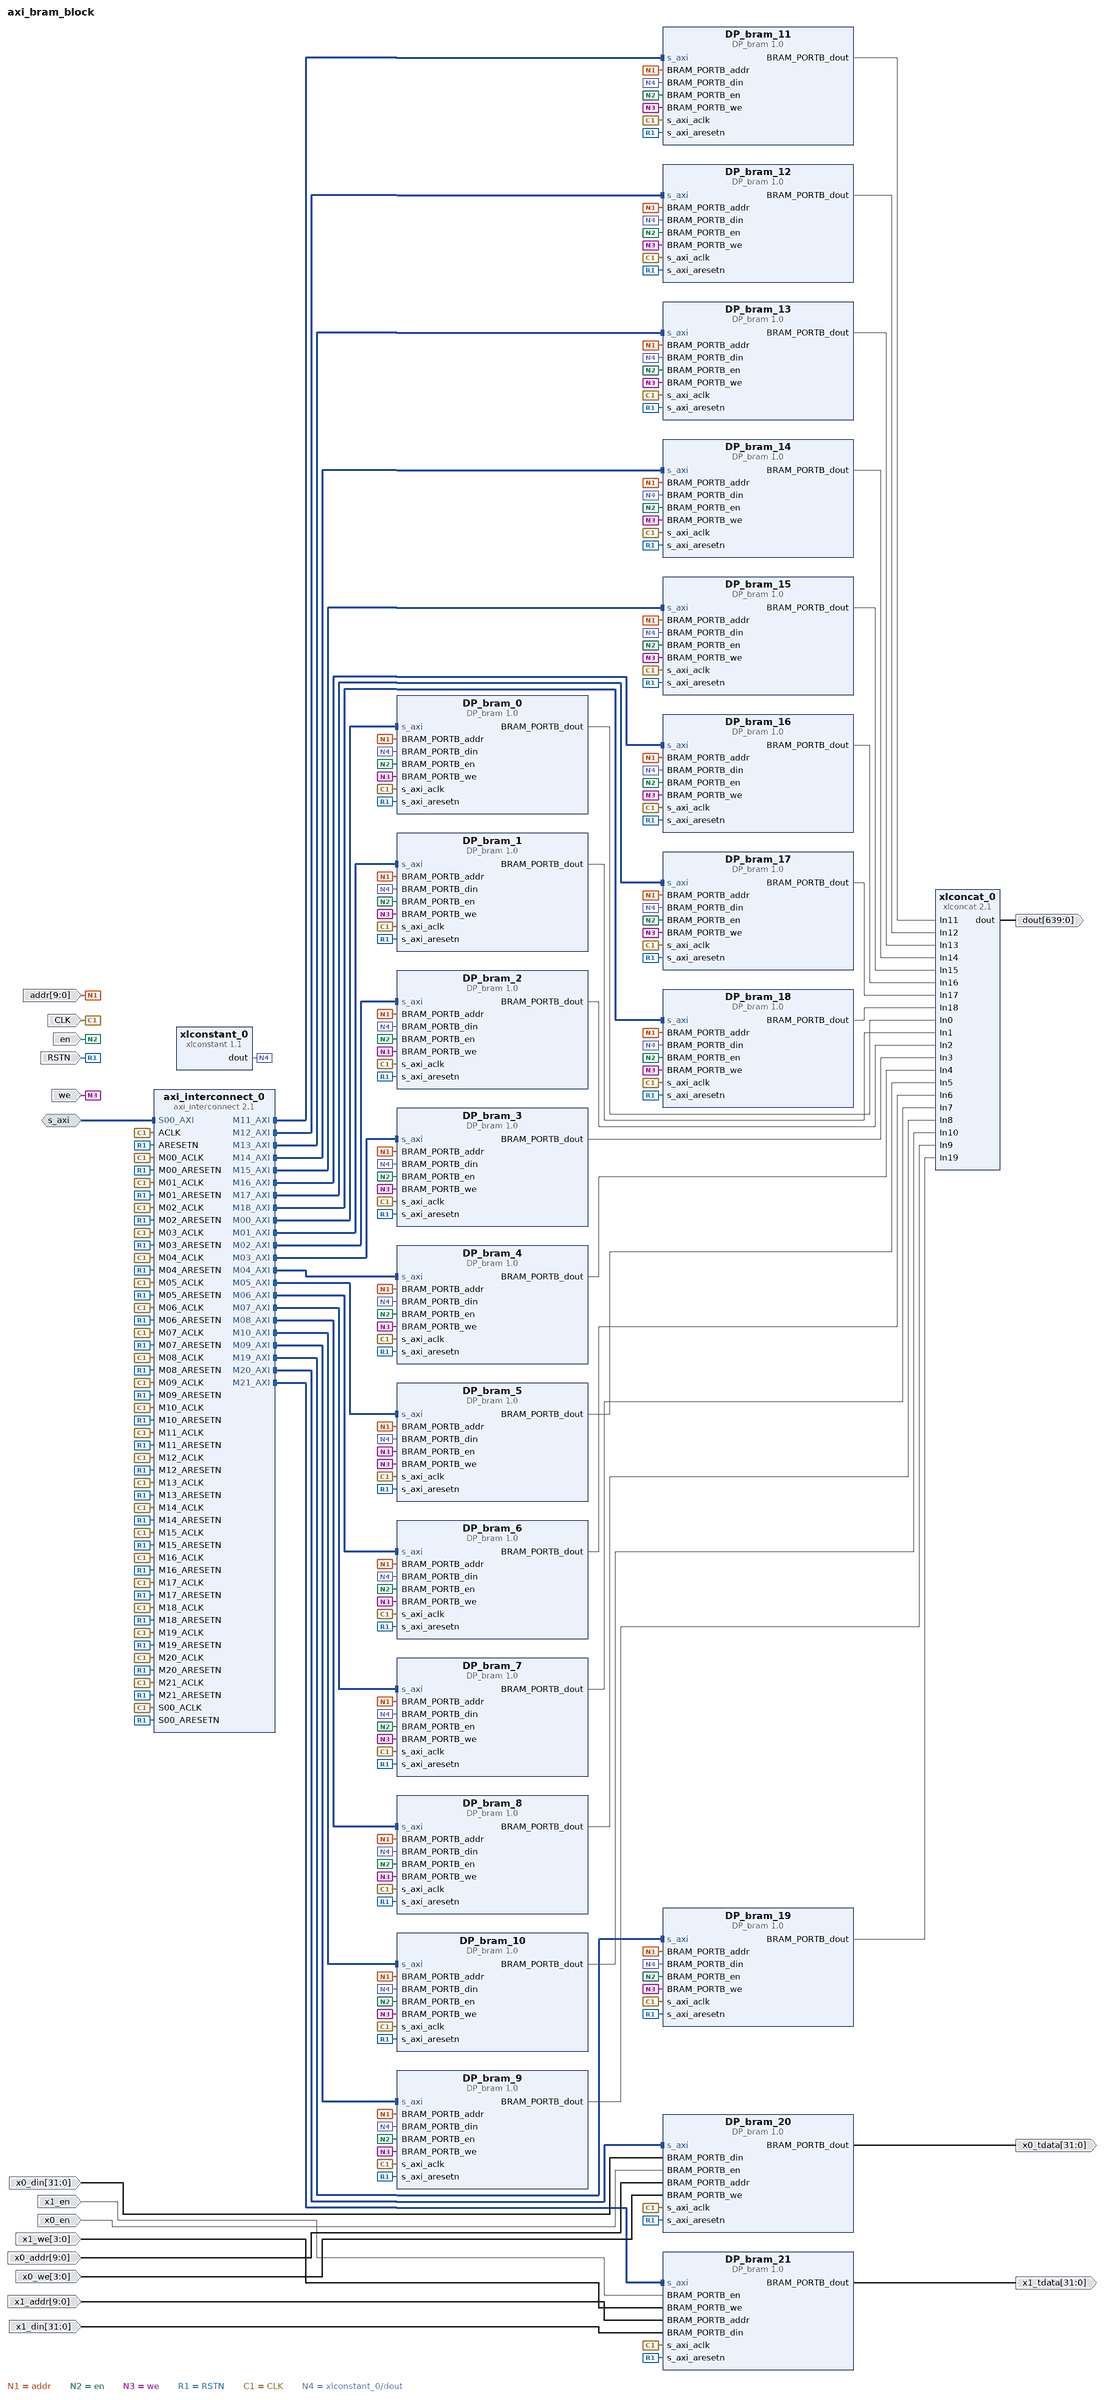
[diagram p0: block diagram of the top level]
# Vivado block design axi_bram_block, xc7z010clg400-1, Vivado 2019.2
create_bd_design axi_bram_block

create_bd_intf_port -mode Slave -vlnv xilinx.com:interface:aximm_rtl:1.0 s_axi
set_property -dict [list \
  CONFIG.DATA_WIDTH 32 \
  CONFIG.PROTOCOL AXI4 \
  CONFIG.ID_WIDTH 0 \
  CONFIG.ADDR_WIDTH 20 \
  CONFIG.AWUSER_WIDTH 0 \
  CONFIG.ARUSER_WIDTH 0 \
  CONFIG.WUSER_WIDTH 0 \
  CONFIG.RUSER_WIDTH 0 \
  CONFIG.BUSER_WIDTH 0 \
  CONFIG.READ_WRITE_MODE READ_WRITE \
  CONFIG.HAS_BURST 1 \
  CONFIG.HAS_LOCK 1 \
  CONFIG.HAS_PROT 1 \
  CONFIG.HAS_CACHE 1 \
  CONFIG.HAS_QOS 1 \
  CONFIG.HAS_REGION 0 \
  CONFIG.HAS_WSTRB 1 \
  CONFIG.HAS_BRESP 1 \
  CONFIG.HAS_RRESP 1 \
  CONFIG.SUPPORTS_NARROW_BURST 1 \
  CONFIG.NUM_READ_OUTSTANDING 2 \
  CONFIG.NUM_WRITE_OUTSTANDING 2 \
  CONFIG.MAX_BURST_LENGTH 256 \
  CONFIG.NUM_READ_THREADS 1 \
  CONFIG.NUM_WRITE_THREADS 1 \
  CONFIG.RUSER_BITS_PER_BYTE 0 \
  CONFIG.WUSER_BITS_PER_BYTE 0 \
] [get_bd_intf_ports s_axi]
create_bd_port -dir I -type clk CLK
set_property -dict {CONFIG.ASSOCIATED_BUSIF s_axi CONFIG.ASSOCIATED_RESET RSTN} [get_bd_ports CLK]
create_bd_port -dir I -type rst RSTN
create_bd_port -dir I -from 9 -to 0 addr
create_bd_port -dir O -from 639 -to 0 dout
create_bd_port -dir I en
create_bd_port -dir I we
create_bd_port -dir O -from 31 -to 0 x0_tdata
create_bd_port -dir O -from 31 -to 0 x1_tdata
create_bd_port -dir I -from 31 -to 0 x0_din
create_bd_port -dir I x1_en
create_bd_port -dir I x0_en
create_bd_port -dir I -from 3 -to 0 x1_we
create_bd_port -dir I -from 9 -to 0 x1_addr
create_bd_port -dir I -from 9 -to 0 x0_addr
create_bd_port -dir I -from 31 -to 0 x1_din
create_bd_port -dir I -from 3 -to 0 x0_we

create_bd_cell -type ip -vlnv xilinx.com:ip:axi_interconnect:2.1 axi_interconnect_0
set_property -dict {CONFIG.ENABLE_ADVANCED_OPTIONS 0 CONFIG.NUM_MI 22} [get_bd_cells axi_interconnect_0]
create_bd_cell -type ip -vlnv xilinx.com:ip:xlconcat:2.1 xlconcat_0
set_property -dict {CONFIG.NUM_PORTS 20} [get_bd_cells xlconcat_0]
create_bd_cell -type ip -vlnv xilinx.com:ip:xlconstant:1.1 xlconstant_0
set_property -dict {CONFIG.CONST_VAL 0 CONFIG.CONST_WIDTH 32} [get_bd_cells xlconstant_0]
create_bd_cell -type ip -vlnv xilinx.com:user:DP_bram:1.0 DP_bram_0
create_bd_cell -type ip -vlnv xilinx.com:user:DP_bram:1.0 DP_bram_10
create_bd_cell -type ip -vlnv xilinx.com:user:DP_bram:1.0 DP_bram_11
create_bd_cell -type ip -vlnv xilinx.com:user:DP_bram:1.0 DP_bram_12
create_bd_cell -type ip -vlnv xilinx.com:user:DP_bram:1.0 DP_bram_13
create_bd_cell -type ip -vlnv xilinx.com:user:DP_bram:1.0 DP_bram_14
create_bd_cell -type ip -vlnv xilinx.com:user:DP_bram:1.0 DP_bram_15
create_bd_cell -type ip -vlnv xilinx.com:user:DP_bram:1.0 DP_bram_16
create_bd_cell -type ip -vlnv xilinx.com:user:DP_bram:1.0 DP_bram_17
create_bd_cell -type ip -vlnv xilinx.com:user:DP_bram:1.0 DP_bram_18
create_bd_cell -type ip -vlnv xilinx.com:user:DP_bram:1.0 DP_bram_19
create_bd_cell -type ip -vlnv xilinx.com:user:DP_bram:1.0 DP_bram_1
create_bd_cell -type ip -vlnv xilinx.com:user:DP_bram:1.0 DP_bram_20
create_bd_cell -type ip -vlnv xilinx.com:user:DP_bram:1.0 DP_bram_21
create_bd_cell -type ip -vlnv xilinx.com:user:DP_bram:1.0 DP_bram_2
create_bd_cell -type ip -vlnv xilinx.com:user:DP_bram:1.0 DP_bram_3
create_bd_cell -type ip -vlnv xilinx.com:user:DP_bram:1.0 DP_bram_4
create_bd_cell -type ip -vlnv xilinx.com:user:DP_bram:1.0 DP_bram_5
create_bd_cell -type ip -vlnv xilinx.com:user:DP_bram:1.0 DP_bram_6
create_bd_cell -type ip -vlnv xilinx.com:user:DP_bram:1.0 DP_bram_7
create_bd_cell -type ip -vlnv xilinx.com:user:DP_bram:1.0 DP_bram_8
create_bd_cell -type ip -vlnv xilinx.com:user:DP_bram:1.0 DP_bram_9

# ---- connections ----

connect_bd_intf_net -intf_net S00_AXI_0_1 [get_bd_intf_ports s_axi] [get_bd_intf_pins axi_interconnect_0/S00_AXI]
connect_bd_intf_net [get_bd_intf_pins axi_interconnect_0/M06_AXI] [get_bd_intf_pins DP_bram_6/s_axi]
connect_bd_intf_net [get_bd_intf_pins axi_interconnect_0/M09_AXI] [get_bd_intf_pins DP_bram_9/s_axi]
connect_bd_intf_net [get_bd_intf_pins axi_interconnect_0/M13_AXI] [get_bd_intf_pins DP_bram_13/s_axi]
connect_bd_intf_net [get_bd_intf_pins axi_interconnect_0/M07_AXI] [get_bd_intf_pins DP_bram_7/s_axi]
connect_bd_intf_net [get_bd_intf_pins axi_interconnect_0/M17_AXI] [get_bd_intf_pins DP_bram_17/s_axi]
connect_bd_intf_net [get_bd_intf_pins DP_bram_21/s_axi] [get_bd_intf_pins axi_interconnect_0/M21_AXI]
connect_bd_intf_net [get_bd_intf_pins axi_interconnect_0/M01_AXI] [get_bd_intf_pins DP_bram_1/s_axi]
connect_bd_intf_net [get_bd_intf_pins axi_interconnect_0/M10_AXI] [get_bd_intf_pins DP_bram_10/s_axi]
connect_bd_intf_net [get_bd_intf_pins axi_interconnect_0/M00_AXI] [get_bd_intf_pins DP_bram_0/s_axi]
connect_bd_intf_net [get_bd_intf_pins axi_interconnect_0/M08_AXI] [get_bd_intf_pins DP_bram_8/s_axi]
connect_bd_intf_net [get_bd_intf_pins axi_interconnect_0/M11_AXI] [get_bd_intf_pins DP_bram_11/s_axi]
connect_bd_intf_net [get_bd_intf_pins axi_interconnect_0/M03_AXI] [get_bd_intf_pins DP_bram_3/s_axi]
connect_bd_intf_net [get_bd_intf_pins axi_interconnect_0/M15_AXI] [get_bd_intf_pins DP_bram_15/s_axi]
connect_bd_intf_net [get_bd_intf_pins axi_interconnect_0/M04_AXI] [get_bd_intf_pins DP_bram_4/s_axi]
connect_bd_intf_net [get_bd_intf_pins axi_interconnect_0/M05_AXI] [get_bd_intf_pins DP_bram_5/s_axi]
connect_bd_intf_net [get_bd_intf_pins axi_interconnect_0/M18_AXI] [get_bd_intf_pins DP_bram_18/s_axi]
connect_bd_intf_net [get_bd_intf_pins DP_bram_20/s_axi] [get_bd_intf_pins axi_interconnect_0/M20_AXI]
connect_bd_intf_net [get_bd_intf_pins axi_interconnect_0/M02_AXI] [get_bd_intf_pins DP_bram_2/s_axi]
connect_bd_intf_net [get_bd_intf_pins axi_interconnect_0/M16_AXI] [get_bd_intf_pins DP_bram_16/s_axi]
connect_bd_intf_net [get_bd_intf_pins axi_interconnect_0/M12_AXI] [get_bd_intf_pins DP_bram_12/s_axi]
connect_bd_intf_net [get_bd_intf_pins axi_interconnect_0/M14_AXI] [get_bd_intf_pins DP_bram_14/s_axi]
connect_bd_intf_net [get_bd_intf_pins axi_interconnect_0/M19_AXI] [get_bd_intf_pins DP_bram_19/s_axi]
connect_bd_net -net BRAM_PORTB_addr_0_1 [get_bd_ports addr] \
  [get_bd_pins DP_bram_0/BRAM_PORTB_addr] [get_bd_pins DP_bram_10/BRAM_PORTB_addr] [get_bd_pins DP_bram_11/BRAM_PORTB_addr] \
  [get_bd_pins DP_bram_12/BRAM_PORTB_addr] [get_bd_pins DP_bram_13/BRAM_PORTB_addr] [get_bd_pins DP_bram_14/BRAM_PORTB_addr] \
  [get_bd_pins DP_bram_15/BRAM_PORTB_addr] [get_bd_pins DP_bram_16/BRAM_PORTB_addr] [get_bd_pins DP_bram_17/BRAM_PORTB_addr] \
  [get_bd_pins DP_bram_18/BRAM_PORTB_addr] [get_bd_pins DP_bram_19/BRAM_PORTB_addr] [get_bd_pins DP_bram_1/BRAM_PORTB_addr] \
  [get_bd_pins DP_bram_2/BRAM_PORTB_addr] [get_bd_pins DP_bram_3/BRAM_PORTB_addr] [get_bd_pins DP_bram_4/BRAM_PORTB_addr] \
  [get_bd_pins DP_bram_5/BRAM_PORTB_addr] [get_bd_pins DP_bram_6/BRAM_PORTB_addr] [get_bd_pins DP_bram_7/BRAM_PORTB_addr] \
  [get_bd_pins DP_bram_8/BRAM_PORTB_addr] [get_bd_pins DP_bram_9/BRAM_PORTB_addr]
connect_bd_net -net BRAM_PORTB_en_0_1 [get_bd_ports en] \
  [get_bd_pins DP_bram_0/BRAM_PORTB_en] [get_bd_pins DP_bram_10/BRAM_PORTB_en] [get_bd_pins DP_bram_11/BRAM_PORTB_en] \
  [get_bd_pins DP_bram_12/BRAM_PORTB_en] [get_bd_pins DP_bram_13/BRAM_PORTB_en] [get_bd_pins DP_bram_14/BRAM_PORTB_en] \
  [get_bd_pins DP_bram_15/BRAM_PORTB_en] [get_bd_pins DP_bram_16/BRAM_PORTB_en] [get_bd_pins DP_bram_17/BRAM_PORTB_en] \
  [get_bd_pins DP_bram_18/BRAM_PORTB_en] [get_bd_pins DP_bram_19/BRAM_PORTB_en] [get_bd_pins DP_bram_1/BRAM_PORTB_en] \
  [get_bd_pins DP_bram_2/BRAM_PORTB_en] [get_bd_pins DP_bram_3/BRAM_PORTB_en] [get_bd_pins DP_bram_4/BRAM_PORTB_en] \
  [get_bd_pins DP_bram_6/BRAM_PORTB_en] [get_bd_pins DP_bram_7/BRAM_PORTB_en] [get_bd_pins DP_bram_8/BRAM_PORTB_en] \
  [get_bd_pins DP_bram_9/BRAM_PORTB_en]
connect_bd_net -net BRAM_PORTB_we_0_1 [get_bd_ports we] \
  [get_bd_pins DP_bram_0/BRAM_PORTB_we] [get_bd_pins DP_bram_10/BRAM_PORTB_we] [get_bd_pins DP_bram_11/BRAM_PORTB_we] \
  [get_bd_pins DP_bram_12/BRAM_PORTB_we] [get_bd_pins DP_bram_13/BRAM_PORTB_we] [get_bd_pins DP_bram_14/BRAM_PORTB_we] \
  [get_bd_pins DP_bram_15/BRAM_PORTB_we] [get_bd_pins DP_bram_16/BRAM_PORTB_we] [get_bd_pins DP_bram_17/BRAM_PORTB_we] \
  [get_bd_pins DP_bram_18/BRAM_PORTB_we] [get_bd_pins DP_bram_19/BRAM_PORTB_we] [get_bd_pins DP_bram_1/BRAM_PORTB_we] \
  [get_bd_pins DP_bram_2/BRAM_PORTB_we] [get_bd_pins DP_bram_3/BRAM_PORTB_we] [get_bd_pins DP_bram_4/BRAM_PORTB_we] \
  [get_bd_pins DP_bram_5/BRAM_PORTB_en] [get_bd_pins DP_bram_5/BRAM_PORTB_we] [get_bd_pins DP_bram_6/BRAM_PORTB_we] \
  [get_bd_pins DP_bram_7/BRAM_PORTB_we] [get_bd_pins DP_bram_8/BRAM_PORTB_we] [get_bd_pins DP_bram_9/BRAM_PORTB_we]
connect_bd_net [get_bd_pins DP_bram_0/BRAM_PORTB_dout] [get_bd_pins xlconcat_0/In0]
connect_bd_net [get_bd_pins DP_bram_10/BRAM_PORTB_dout] [get_bd_pins xlconcat_0/In10]
connect_bd_net [get_bd_pins DP_bram_11/BRAM_PORTB_dout] [get_bd_pins xlconcat_0/In11]
connect_bd_net [get_bd_pins DP_bram_12/BRAM_PORTB_dout] [get_bd_pins xlconcat_0/In12]
connect_bd_net [get_bd_pins DP_bram_13/BRAM_PORTB_dout] [get_bd_pins xlconcat_0/In13]
connect_bd_net [get_bd_pins DP_bram_14/BRAM_PORTB_dout] [get_bd_pins xlconcat_0/In14]
connect_bd_net [get_bd_pins DP_bram_15/BRAM_PORTB_dout] [get_bd_pins xlconcat_0/In15]
connect_bd_net [get_bd_pins DP_bram_16/BRAM_PORTB_dout] [get_bd_pins xlconcat_0/In16]
connect_bd_net [get_bd_pins DP_bram_17/BRAM_PORTB_dout] [get_bd_pins xlconcat_0/In17]
connect_bd_net [get_bd_pins DP_bram_18/BRAM_PORTB_dout] [get_bd_pins xlconcat_0/In18]
connect_bd_net [get_bd_pins DP_bram_19/BRAM_PORTB_dout] [get_bd_pins xlconcat_0/In19]
connect_bd_net [get_bd_pins DP_bram_1/BRAM_PORTB_dout] [get_bd_pins xlconcat_0/In1]
connect_bd_net [get_bd_pins DP_bram_2/BRAM_PORTB_dout] [get_bd_pins xlconcat_0/In2]
connect_bd_net [get_bd_pins DP_bram_3/BRAM_PORTB_dout] [get_bd_pins xlconcat_0/In3]
connect_bd_net [get_bd_pins DP_bram_4/BRAM_PORTB_dout] [get_bd_pins xlconcat_0/In4]
connect_bd_net [get_bd_pins DP_bram_5/BRAM_PORTB_dout] [get_bd_pins xlconcat_0/In5]
connect_bd_net [get_bd_pins DP_bram_6/BRAM_PORTB_dout] [get_bd_pins xlconcat_0/In6]
connect_bd_net [get_bd_pins DP_bram_7/BRAM_PORTB_dout] [get_bd_pins xlconcat_0/In7]
connect_bd_net [get_bd_pins DP_bram_8/BRAM_PORTB_dout] [get_bd_pins xlconcat_0/In8]
connect_bd_net [get_bd_pins DP_bram_9/BRAM_PORTB_dout] [get_bd_pins xlconcat_0/In9]
connect_bd_net -net rst_s_axi_aclk_0_100M_peripheral_aresetn [get_bd_ports RSTN] \
  [get_bd_pins axi_interconnect_0/ARESETN] [get_bd_pins axi_interconnect_0/M00_ARESETN] \
  [get_bd_pins axi_interconnect_0/M01_ARESETN] [get_bd_pins axi_interconnect_0/M02_ARESETN] \
  [get_bd_pins axi_interconnect_0/M03_ARESETN] [get_bd_pins axi_interconnect_0/M04_ARESETN] \
  [get_bd_pins axi_interconnect_0/M05_ARESETN] [get_bd_pins axi_interconnect_0/M06_ARESETN] \
  [get_bd_pins axi_interconnect_0/M07_ARESETN] [get_bd_pins axi_interconnect_0/M08_ARESETN] \
  [get_bd_pins axi_interconnect_0/M09_ARESETN] [get_bd_pins axi_interconnect_0/M10_ARESETN] \
  [get_bd_pins axi_interconnect_0/M11_ARESETN] [get_bd_pins axi_interconnect_0/M12_ARESETN] \
  [get_bd_pins axi_interconnect_0/M13_ARESETN] [get_bd_pins axi_interconnect_0/M14_ARESETN] \
  [get_bd_pins axi_interconnect_0/M15_ARESETN] [get_bd_pins axi_interconnect_0/M16_ARESETN] \
  [get_bd_pins axi_interconnect_0/M17_ARESETN] [get_bd_pins axi_interconnect_0/M18_ARESETN] \
  [get_bd_pins axi_interconnect_0/M19_ARESETN] [get_bd_pins axi_interconnect_0/S00_ARESETN] \
  [get_bd_pins axi_interconnect_0/M20_ARESETN] [get_bd_pins axi_interconnect_0/M21_ARESETN] \
  [get_bd_pins DP_bram_0/s_axi_aresetn] [get_bd_pins DP_bram_10/s_axi_aresetn] [get_bd_pins DP_bram_11/s_axi_aresetn] \
  [get_bd_pins DP_bram_12/s_axi_aresetn] [get_bd_pins DP_bram_13/s_axi_aresetn] [get_bd_pins DP_bram_14/s_axi_aresetn] \
  [get_bd_pins DP_bram_15/s_axi_aresetn] [get_bd_pins DP_bram_16/s_axi_aresetn] [get_bd_pins DP_bram_17/s_axi_aresetn] \
  [get_bd_pins DP_bram_18/s_axi_aresetn] [get_bd_pins DP_bram_19/s_axi_aresetn] [get_bd_pins DP_bram_1/s_axi_aresetn] \
  [get_bd_pins DP_bram_20/s_axi_aresetn] [get_bd_pins DP_bram_21/s_axi_aresetn] [get_bd_pins DP_bram_2/s_axi_aresetn] \
  [get_bd_pins DP_bram_3/s_axi_aresetn] [get_bd_pins DP_bram_4/s_axi_aresetn] [get_bd_pins DP_bram_5/s_axi_aresetn] \
  [get_bd_pins DP_bram_6/s_axi_aresetn] [get_bd_pins DP_bram_7/s_axi_aresetn] [get_bd_pins DP_bram_8/s_axi_aresetn] \
  [get_bd_pins DP_bram_9/s_axi_aresetn]
connect_bd_net -net s_axi_aclk_0_1 [get_bd_ports CLK] \
  [get_bd_pins axi_interconnect_0/ACLK] [get_bd_pins axi_interconnect_0/M00_ACLK] [get_bd_pins axi_interconnect_0/M01_ACLK] \
  [get_bd_pins axi_interconnect_0/M02_ACLK] [get_bd_pins axi_interconnect_0/M03_ACLK] \
  [get_bd_pins axi_interconnect_0/M04_ACLK] [get_bd_pins axi_interconnect_0/M05_ACLK] \
  [get_bd_pins axi_interconnect_0/M06_ACLK] [get_bd_pins axi_interconnect_0/M07_ACLK] \
  [get_bd_pins axi_interconnect_0/M08_ACLK] [get_bd_pins axi_interconnect_0/M09_ACLK] \
  [get_bd_pins axi_interconnect_0/M10_ACLK] [get_bd_pins axi_interconnect_0/M11_ACLK] \
  [get_bd_pins axi_interconnect_0/M12_ACLK] [get_bd_pins axi_interconnect_0/M13_ACLK] \
  [get_bd_pins axi_interconnect_0/M14_ACLK] [get_bd_pins axi_interconnect_0/M15_ACLK] \
  [get_bd_pins axi_interconnect_0/M16_ACLK] [get_bd_pins axi_interconnect_0/M17_ACLK] \
  [get_bd_pins axi_interconnect_0/M18_ACLK] [get_bd_pins axi_interconnect_0/M19_ACLK] \
  [get_bd_pins axi_interconnect_0/S00_ACLK] [get_bd_pins axi_interconnect_0/M20_ACLK] \
  [get_bd_pins axi_interconnect_0/M21_ACLK] [get_bd_pins DP_bram_0/s_axi_aclk] [get_bd_pins DP_bram_10/s_axi_aclk] \
  [get_bd_pins DP_bram_11/s_axi_aclk] [get_bd_pins DP_bram_12/s_axi_aclk] [get_bd_pins DP_bram_13/s_axi_aclk] \
  [get_bd_pins DP_bram_14/s_axi_aclk] [get_bd_pins DP_bram_15/s_axi_aclk] [get_bd_pins DP_bram_16/s_axi_aclk] \
  [get_bd_pins DP_bram_17/s_axi_aclk] [get_bd_pins DP_bram_18/s_axi_aclk] [get_bd_pins DP_bram_19/s_axi_aclk] \
  [get_bd_pins DP_bram_1/s_axi_aclk] [get_bd_pins DP_bram_20/s_axi_aclk] [get_bd_pins DP_bram_21/s_axi_aclk] \
  [get_bd_pins DP_bram_2/s_axi_aclk] [get_bd_pins DP_bram_3/s_axi_aclk] [get_bd_pins DP_bram_4/s_axi_aclk] \
  [get_bd_pins DP_bram_5/s_axi_aclk] [get_bd_pins DP_bram_6/s_axi_aclk] [get_bd_pins DP_bram_7/s_axi_aclk] \
  [get_bd_pins DP_bram_8/s_axi_aclk] [get_bd_pins DP_bram_9/s_axi_aclk]
connect_bd_net [get_bd_pins xlconcat_0/dout] [get_bd_ports dout]
connect_bd_net [get_bd_pins xlconstant_0/dout] \
  [get_bd_pins DP_bram_0/BRAM_PORTB_din] [get_bd_pins DP_bram_10/BRAM_PORTB_din] [get_bd_pins DP_bram_11/BRAM_PORTB_din] \
  [get_bd_pins DP_bram_12/BRAM_PORTB_din] [get_bd_pins DP_bram_13/BRAM_PORTB_din] [get_bd_pins DP_bram_14/BRAM_PORTB_din] \
  [get_bd_pins DP_bram_15/BRAM_PORTB_din] [get_bd_pins DP_bram_16/BRAM_PORTB_din] [get_bd_pins DP_bram_17/BRAM_PORTB_din] \
  [get_bd_pins DP_bram_18/BRAM_PORTB_din] [get_bd_pins DP_bram_19/BRAM_PORTB_din] [get_bd_pins DP_bram_1/BRAM_PORTB_din] \
  [get_bd_pins DP_bram_2/BRAM_PORTB_din] [get_bd_pins DP_bram_3/BRAM_PORTB_din] [get_bd_pins DP_bram_4/BRAM_PORTB_din] \
  [get_bd_pins DP_bram_5/BRAM_PORTB_din] [get_bd_pins DP_bram_6/BRAM_PORTB_din] [get_bd_pins DP_bram_7/BRAM_PORTB_din] \
  [get_bd_pins DP_bram_8/BRAM_PORTB_din] [get_bd_pins DP_bram_9/BRAM_PORTB_din]
connect_bd_net [get_bd_pins DP_bram_20/BRAM_PORTB_dout] [get_bd_ports x0_tdata]
connect_bd_net [get_bd_pins DP_bram_21/BRAM_PORTB_dout] [get_bd_ports x1_tdata]
connect_bd_net -net BRAM_PORTB_din_0_1 [get_bd_ports x0_din] [get_bd_pins DP_bram_20/BRAM_PORTB_din]
connect_bd_net -net BRAM_PORTB_en_0_2 [get_bd_ports x1_en] [get_bd_pins DP_bram_21/BRAM_PORTB_en]
connect_bd_net -net BRAM_PORTB_en_1_1 [get_bd_ports x0_en] [get_bd_pins DP_bram_20/BRAM_PORTB_en]
connect_bd_net -net BRAM_PORTB_we_0_2 [get_bd_ports x1_we] [get_bd_pins DP_bram_21/BRAM_PORTB_we]
connect_bd_net -net BRAM_PORTB_addr_0_2 [get_bd_ports x1_addr] [get_bd_pins DP_bram_21/BRAM_PORTB_addr]
connect_bd_net -net BRAM_PORTB_addr_1_1 [get_bd_ports x0_addr] [get_bd_pins DP_bram_20/BRAM_PORTB_addr]
connect_bd_net -net BRAM_PORTB_din_1_1 [get_bd_ports x1_din] [get_bd_pins DP_bram_21/BRAM_PORTB_din]
connect_bd_net -net BRAM_PORTB_we_1_1 [get_bd_ports x0_we] [get_bd_pins DP_bram_20/BRAM_PORTB_we]

# ---- address map ----
assign_bd_address -offset 0x01000 -range 4K -target_address_space [get_bd_addr_spaces s_axi] [get_bd_addr_segs DP_bram_0/s_axi/reg0]
assign_bd_address -offset 0x02000 -range 4K -target_address_space [get_bd_addr_spaces s_axi] [get_bd_addr_segs DP_bram_1/s_axi/reg0]
assign_bd_address -offset 0x03000 -range 4K -target_address_space [get_bd_addr_spaces s_axi] [get_bd_addr_segs DP_bram_2/s_axi/reg0]
assign_bd_address -offset 0x04000 -range 4K -target_address_space [get_bd_addr_spaces s_axi] [get_bd_addr_segs DP_bram_3/s_axi/reg0]
assign_bd_address -offset 0x05000 -range 4K -target_address_space [get_bd_addr_spaces s_axi] [get_bd_addr_segs DP_bram_4/s_axi/reg0]
assign_bd_address -offset 0x06000 -range 4K -target_address_space [get_bd_addr_spaces s_axi] [get_bd_addr_segs DP_bram_5/s_axi/reg0]
assign_bd_address -offset 0x07000 -range 4K -target_address_space [get_bd_addr_spaces s_axi] [get_bd_addr_segs DP_bram_6/s_axi/reg0]
assign_bd_address -offset 0x08000 -range 4K -target_address_space [get_bd_addr_spaces s_axi] [get_bd_addr_segs DP_bram_7/s_axi/reg0]
assign_bd_address -offset 0x09000 -range 4K -target_address_space [get_bd_addr_spaces s_axi] [get_bd_addr_segs DP_bram_8/s_axi/reg0]
assign_bd_address -offset 0x0A000 -range 4K -target_address_space [get_bd_addr_spaces s_axi] [get_bd_addr_segs DP_bram_9/s_axi/reg0]
assign_bd_address -offset 0x0B000 -range 4K -target_address_space [get_bd_addr_spaces s_axi] [get_bd_addr_segs DP_bram_10/s_axi/reg0]
assign_bd_address -offset 0x0C000 -range 4K -target_address_space [get_bd_addr_spaces s_axi] [get_bd_addr_segs DP_bram_11/s_axi/reg0]
assign_bd_address -offset 0x0D000 -range 4K -target_address_space [get_bd_addr_spaces s_axi] [get_bd_addr_segs DP_bram_12/s_axi/reg0]
assign_bd_address -offset 0x0E000 -range 4K -target_address_space [get_bd_addr_spaces s_axi] [get_bd_addr_segs DP_bram_13/s_axi/reg0]
assign_bd_address -offset 0x0F000 -range 4K -target_address_space [get_bd_addr_spaces s_axi] [get_bd_addr_segs DP_bram_14/s_axi/reg0]
assign_bd_address -offset 0x10000 -range 4K -target_address_space [get_bd_addr_spaces s_axi] [get_bd_addr_segs DP_bram_15/s_axi/reg0]
assign_bd_address -offset 0x11000 -range 4K -target_address_space [get_bd_addr_spaces s_axi] [get_bd_addr_segs DP_bram_16/s_axi/reg0]
assign_bd_address -offset 0x12000 -range 4K -target_address_space [get_bd_addr_spaces s_axi] [get_bd_addr_segs DP_bram_17/s_axi/reg0]
assign_bd_address -offset 0x13000 -range 4K -target_address_space [get_bd_addr_spaces s_axi] [get_bd_addr_segs DP_bram_18/s_axi/reg0]
assign_bd_address -offset 0x14000 -range 4K -target_address_space [get_bd_addr_spaces s_axi] [get_bd_addr_segs DP_bram_19/s_axi/reg0]
assign_bd_address -offset 0x20000 -range 4K -target_address_space [get_bd_addr_spaces s_axi] [get_bd_addr_segs DP_bram_20/s_axi/reg0]
assign_bd_address -offset 0x21000 -range 4K -target_address_space [get_bd_addr_spaces s_axi] [get_bd_addr_segs DP_bram_21/s_axi/reg0]

validate_bd_design
save_bd_design
